# Altium schematic sheet Main.SchDoc
size A4; DocumentNumber: 1; SheetNumber: 1; SheetTotal: 3
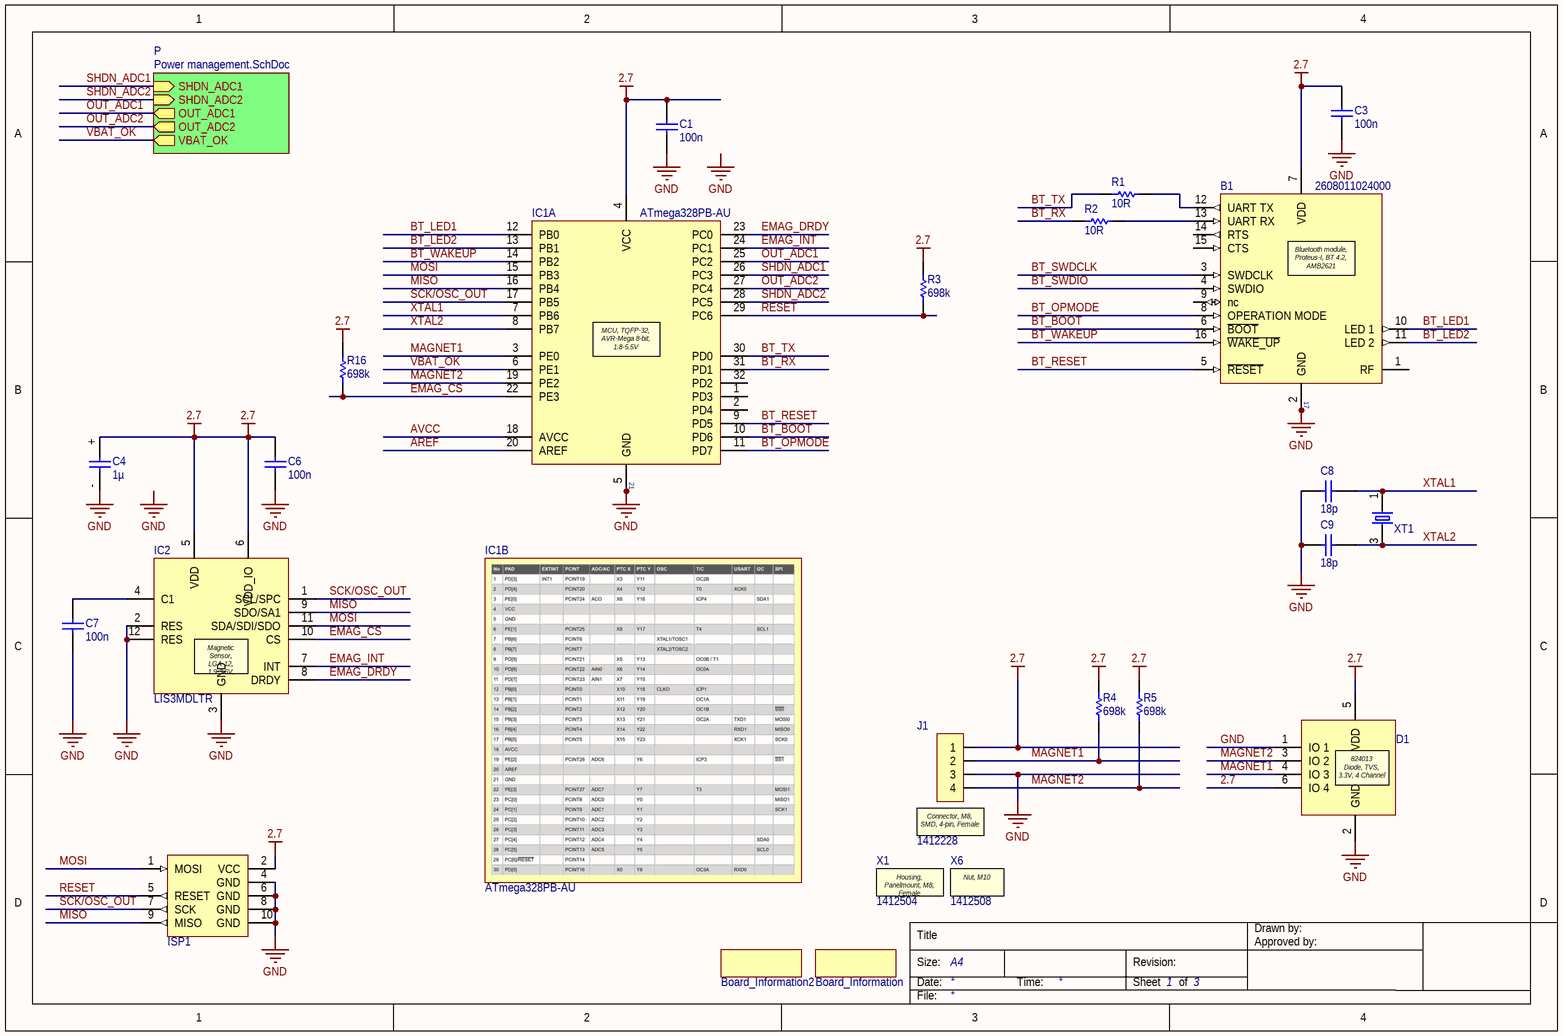
[diagram p0: Main.SchDoc]

## Parts
B1  2608011024000  [AMB2621]
Board_Information  Board_Information  [Board_Information]  (value not drawn)  (no BOM)
Board_Information2  Board_Information  [Board_Information]  (value not drawn)  (no BOM)
C1  value 100n  [C0603]  (hidden comment: CC0603KRX7R9BB104)
C3  value 100n  [C0603]  (hidden comment: CC0603KRX7R9BB104)
C4  value 1µ  [ELCAP_4x5.4mm]  (hidden comment: EEE-FC1V1R0R)
C6  value 100n  [C0603]  (hidden comment: CC0603KRX7R9BB104)
C7  value 100n  [C0603]  (hidden comment: CC0603KRX7R9BB104)
C8  value 18p  [C0603]  (hidden comment: C0603C180J5GACTU)
C9  value 18p  [C0603]  (hidden comment: C0603C180J5GACTU)
D1  824013  [SOT-23-6]  (value not drawn)
IC1  ATmega328PB-AU  [TQFP-32]  (parts A,B of 2)
IC2  LIS3MDLTR  [LGA-12]
ISP1  TC2050-IDC-NL  [TC2050-IDC-NL]  (value not drawn)  (no BOM)
J1  1412228  [1412228]
R1  value 10R  [R0603]  (hidden comment: ERJ-3EKF10R0V)
R2  value 10R  [R0603]  (hidden comment: ERJ-3EKF10R0V)
R3  value 698k  [R0603]  (hidden comment: ERJ-3EKF6983V)
R4  value 698k  [R0603]  (hidden comment: ERJ-3EKF6983V)
R5  value 698k  [R0603]  (hidden comment: ERJ-3EKF6983V)
R16  value 698k  [R0603]  (hidden comment: ERJ-3EKF6983V)
X1  1412504  [1412504]
X6  1412508  [1412508]  (mechanical)
XT1  ABMM2-7.3728MHZ-E2-T  [Crystal_6x3.6mm]  (value not drawn)

## Sub-sheets
P = Power management.SchDoc: SHDN_ADC1 (in), SHDN_ADC2 (in), OUT_ADC1 (out), OUT_ADC2 (out), VBAT_OK (out)

## Nets
2.7: B1.7(VDD) C1.2 C3.2 C4.+ C6.2 D1.5(VDD) D1.6(IO_4) IC1.4(VCC) IC2.5(VDD) IC2.6(VDD_IO) ISP1.2(VCC) J1.1 R3.2 R4.2 R5.2 R16.2
GND: B1.2(GND) B1.17(GND) C1.1 C3.1 C4.- C6.1 C7.1 C8.1 C9.1 D1.1(IO_1) D1.2(GND) IC1.5(GND) IC1.21(GND) IC2.2(RES) IC2.3(GND) IC2.12(RES) ISP1.4(GND) ISP1.6(GND) ISP1.8(GND) ISP1.10(GND) J1.3
AREF: IC1.20(AREF)
AVCC: IC1.18(AVCC)
BT_BOOT: B1.6(~{BOOT}) IC1.10(PD6)
BT_LED1: B1.10(LED_1) IC1.12(PB0)
BT_LED2: B1.11(LED_2) IC1.13(PB1)
BT_OPMODE: B1.8(OPERATION_MODE) IC1.11(PD7)
BT_RESET: B1.5(~{RESET}) IC1.9(PD5)
BT_RX: IC1.31(PD1) R2.1
BT_SWDCLK: B1.3(SWDCLK)
BT_SWDIO: B1.4(SWDIO)
BT_TX: IC1.30(PD0) R1.1
BT_WAKEUP: B1.16(~{WAKE_UP}) IC1.14(PB2)
EMAG_CS: IC1.22(PE3) IC2.10(CS) R16.1
EMAG_DRDY: IC1.23(PC0) IC2.8(DRDY)
EMAG_INT: IC1.24(PC1) IC2.7(INT)
MAGNET1: D1.4(IO_3) IC1.3(PE0) J1.2 R4.1
MAGNET2: D1.3(IO_2) IC1.19(PE2) J1.4 R5.1
MISO: IC1.16(PB4) IC2.9(SDO/SA1) ISP1.9(MISO)
MOSI: IC1.15(PB3) IC2.11(SDA/SDI/SDO) ISP1.1(MOSI)
OUT_ADC1: IC1.25(PC2) ; sheet P/OUT_ADC1
OUT_ADC2: IC1.27(PC4) ; sheet P/OUT_ADC2
RESET: IC1.29(PC6) ISP1.5(RESET) R3.1
SCK/OSC_OUT: IC1.17(PB5) IC2.1(SCL/SPC) ISP1.7(SCK)
SHDN_ADC1: IC1.26(PC3) ; sheet P/SHDN_ADC1
SHDN_ADC2: IC1.28(PC5) ; sheet P/SHDN_ADC2
VBAT_OK: IC1.6(PE1) ; sheet P/VBAT_OK
XTAL1: C8.2 IC1.7(PB6) XT1.1
XTAL2: C9.2 IC1.8(PB7) XT1.3
NetB1_12: B1.12(UART_TX) R1.2
NetB1_13: B1.13(UART_RX) R2.2
NetC7_2: C7.2 IC2.4(C1)

Not connected (* = marked no-connect by the designer): B1 1(RF) 9(nc) 14(RTS) 15(CTS); IC1 1(PD3) 2(PD4) 32(PD2)

## Notes on the sheet
- Labels drawn without touching a wire or pin: GND
- Title
- Size:
- Date:
- A4
- Time:
- Revision:
- Sheet
- of
- Drawn by:
- Approved by:
- File:
- (in symbol 824013) 824013 / Diode, TVS, 3.3V, 4 Channel
- (in symbol 2608011024000) Bluetooth module, Proteus-I, BT 4.2, AMB2621 /

## Library data of the parts
B1 = 2608011024000: Bluetooth module, Proteus-I, BT 4.2, AMB2621; Manufacturer: Würth Elektronik; ComponentLink4URL: P:/ProteusI_2608011x2400x.pdf; ComponentLink4Description: Manual; OC_FEPA: *; ComponentLink3Description: Drawing; ComponentLink3URL: P:/2608011024000.pdf; Supplier 1: Digi-Key; Supplier Part Number 1: 1917-1014-1-ND; Supplier 2: Farnell; Supplier Part Number 2: 2917636; MPN: 2608011024000
Board_Information Board_Information2 = Board_Information: Board Information
C1 C3 C6 C7 = CC0603KRX7R9BB104: Cap, 100n, 0603, X7R, 50V; Manufacturer: Yageo; Rated Voltage: 50V; Dielectric: X7R; Temperature: 125°C; ComponentLink2URL: P:/UPY-GPHC_X7R_6.3V-to-50V_18.pdf; ComponentLink2Description: Part Series Datasheet; OC_FEPA: 1031198; Supplier 1: Digi-Key; Supplier Part Number 1: 311-1344-1-ND; Supplier Part Number 2: -; Supplier 2: Farnell; Supplier 3: Mouser; Supplier Part Number 3: 603-CC603KRX7R9BB104; MPN: CC0603KRX7R9BB104
C4 = EEE-FC1V1R0R: Cap, 1µ, 4x5.4mm, Aluminum Electrolyte, 35V; Manufacturer: Panasonic; Rated Voltage: 35V; Dielectric: Aluminum Electrolyte; Temperature: 105°C; ComponentLink2URL: P:/ABA0000C1172.pdf; ComponentLink2Description: Part Series Datasheet; OC_FEPA: *; MPN: EEE-FC1V1R0R; Supplier 1: Digi-Key; Supplier Part Number 1: PCE4024CT-ND; Supplier 2: Farnell; Supplier Part Number 2: 2357339; Supplier 3: Mouser; Supplier Part Number 3: 667-EEE-FC1V1R0R
C8 C9 = C0603C180J5GACTU: Cap, 18p, 0603, C0G, 50V; Manufacturer: Kemet; Rated Voltage: 50V; Dielectric: C0G; ComponentLink2URL: P:/KEM_C1003_C0G_SMD.pdf; ComponentLink2Description: Part Series Datasheet; OC_FEPA: *; MPN: C0603C180J5GACTU; Supplier 1: Digi-Key; Supplier Part Number 1: 399-1052-1-ND; Supplier 2: Farnell; Supplier Part Number 2: 1414620; Supplier 3: Mouser; Supplier Part Number 3: 80-C0603C180J5G
D1 = 824013: Diode, TVS, 3.3V, 4 Channel; Manufacturer: Würth Electronics; ComponentLink1URL: P:/824013.pdf; ComponentLink1Description: Datasheet; OC_FEPA: *; MPN: 824013; Supplier 1: Digi-Key; Supplier Part Number 1: 732-4466-1-ND; Supplier 2: Farnell; Supplier Part Number 2: 1825869; Supplier 3: Mouser; Supplier Part Number 3: 710-824013; Supplier 4: RSComponents; Supplier Part Number 4: 7546222
IC1 = ATmega328PB-AU: MCU, TQFP-32, AVR-Mega 8-bit, 1.8-5.5V; Manufacturer: Microchip; ComponentLink1URL: P:/40001906C.pdf; ComponentLink1Description: Datasheet; OC_FEPA: *; Supplier 1: Digi-Key; Supplier Part Number 1: ATMEGA328PB-AU-ND; Supplier 2: Farnell; Supplier Part Number 2: 2523203; Supplier 3: Mouser; Supplier Part Number 3: 556-ATMEGA328PB-AU; Supplier 4: RSComponents; Supplier Part Number 4: 1468928; MPN: ATmega328PB-AU
IC2 = LIS3MDLTR: Magnetic Sensor, LGA-12, 1.9-3.6V, +/-1.6mT; Manufacturer: ST Microelectronics; ComponentLink1URL: P:/en.DM00075867.pdf; ComponentLink1Description: Datasheet; OC_FEPA: *; Supplier 1: Digi-Key; Supplier Part Number 1: 497-13892-1-ND; Supplier 2: Farnell; Supplier Part Number 2: 2433083; Supplier 3: Mouser; Supplier Part Number 3: 511-LIS3MDLTR; Supplier 4: RSComponents; Supplier Part Number 4: 9172725; MPN: LIS3MDLTR
J1 = 1412228: Connector, M8, SMD, 4-pin, Female; Manufacturer: Phoenix Contact; ComponentLink1URL: P:/1412228.pdf; ComponentLink1Description: Datasheet; OC_FEPA: *; ComponentLink2Description: Part Series Datasheet; ComponentLink2URL: P:/52003587_EN_US_PLUSCON_circular_M5_M8_M12_LoRes.pdf; MPN: 1412228; Supplier 1: Digi-Key; Supplier Part Number 1: 1412228-ND; Supplier 2: Farnell; Supplier Part Number 2: -; Supplier 3: Mouser; Supplier Part Number 3: 651-1412228
R1 R2 = ERJ-3EKF10R0V: Res, 10R, 0603, 1%, 100mW, 50V; Manufacturer: Panasonic; Temperature Coefficient: 100ppm; Rated Voltage: 50V; Tolerance: 1%; Type: Thick Film; Rated Power: 100mW; OC_FEPA: *; ComponentLink2URL: P:/Panasonic-Precision_Thick_Film_Chip_Resistors-datasheet.pdf; ComponentLink2Description: Part Series Datasheet; Supplier 1: Digi-Key; Supplier Part Number 1: P10.0HCT-ND; Supplier 2: Farnell; Supplier Part Number 2: 2302958; Supplier 3: Mouser; Supplier Part Number 3: 667-ERJ-3EKF10R0V; MPN: ERJ-3EKF10R0V
R3-R5 R16 = ERJ-3EKF6983V: Res, 698k, 0603, 1%, 75V, 100mW; Manufacturer: Panasonic Electronic Components; Temperature Coefficient: 100ppm; Rated Voltage: 75V; Tolerance: 1%; Type: Thick Film; Rated Power: 100mW; OC_FEPA: *; ComponentLink2URL: P:/AOA0000C304.pdf; ComponentLink2Description: Part Series Datasheet; MPN: ERJ-3EKF6983V; Supplier 1: Digi-Key; Supplier Part Number 1: P698KHCT-ND; Supplier 2: Farnell; Supplier Part Number 2: 2303307; Supplier 3: Mouser; Supplier Part Number 3: 667-ERJ-3EKF6983V
X1 = 1412504: Housing, Panelmount, M8, Female; Manufacturer: Phoenix Contact; ComponentLink1URL: P:/1412504.pdf; ComponentLink1Description: Datasheet; OC_FEPA: 1030987; Supplier 1: Digi-Key; Supplier Part Number 1: 277-10310-ND; Supplier 2: Farnell; Supplier Part Number 2: -; Supplier 3: Mouser; Supplier Part Number 3: 651-1412504; MPN: 1412504
X6 = 1412508: Nut, M10; Manufacturer: Phoenix Contact; ComponentLink1URL: P:/1412508.pdf; ComponentLink1Description: Datasheet; OC_FEPA: 1030988; Supplier 1: Digi-Key; Supplier Part Number 1: 277-10312-ND; Supplier 2: Farnell; Supplier Part Number 2: -; Supplier 3: Mouser; Supplier Part Number 3: 651-1412508; MPN: 1412508
XT1 = ABMM2-7.3728MHZ-E2-T: Crystal, SMD, 7.3728MHz, 18pF; Manufacturer: Abracon; ComponentLink1URL: P:/Abracon-ABMM2-7.3728MHZ-E2-T-datasheet.pdf; ComponentLink1Description: Datasheet; OC_FEPA: *; MPN: ABMM2-7.3728MHZ-E2-T; Supplier 1: Digi-Key; Supplier Part Number 1: 535-10157-1-ND; Supplier 2: Farnell; Supplier Part Number 2: 2467857; Supplier 3: Mouser; Supplier Part Number 3: 815-ABMM2-7.3-E2-T; Supplier 4: RSComponents; Supplier Part Number 4: 1712788